# EAGLE board dnc (EAGLE 7.1.0)
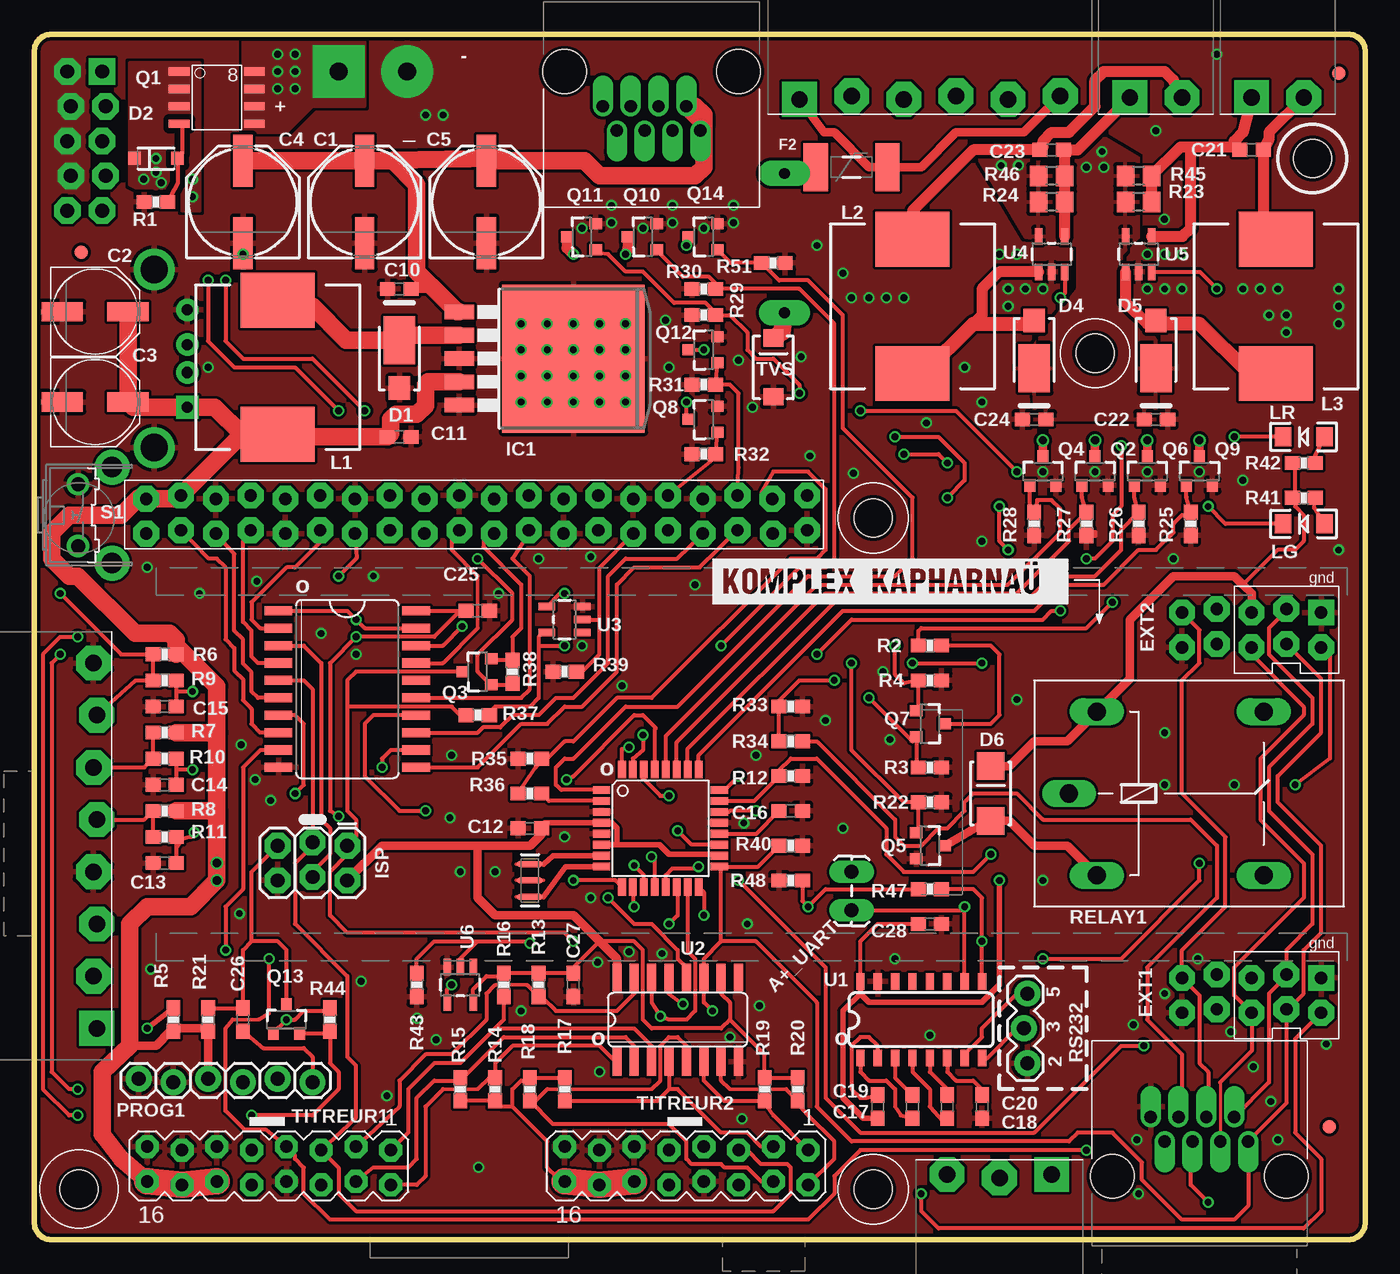
[diagram p1: board, top side]
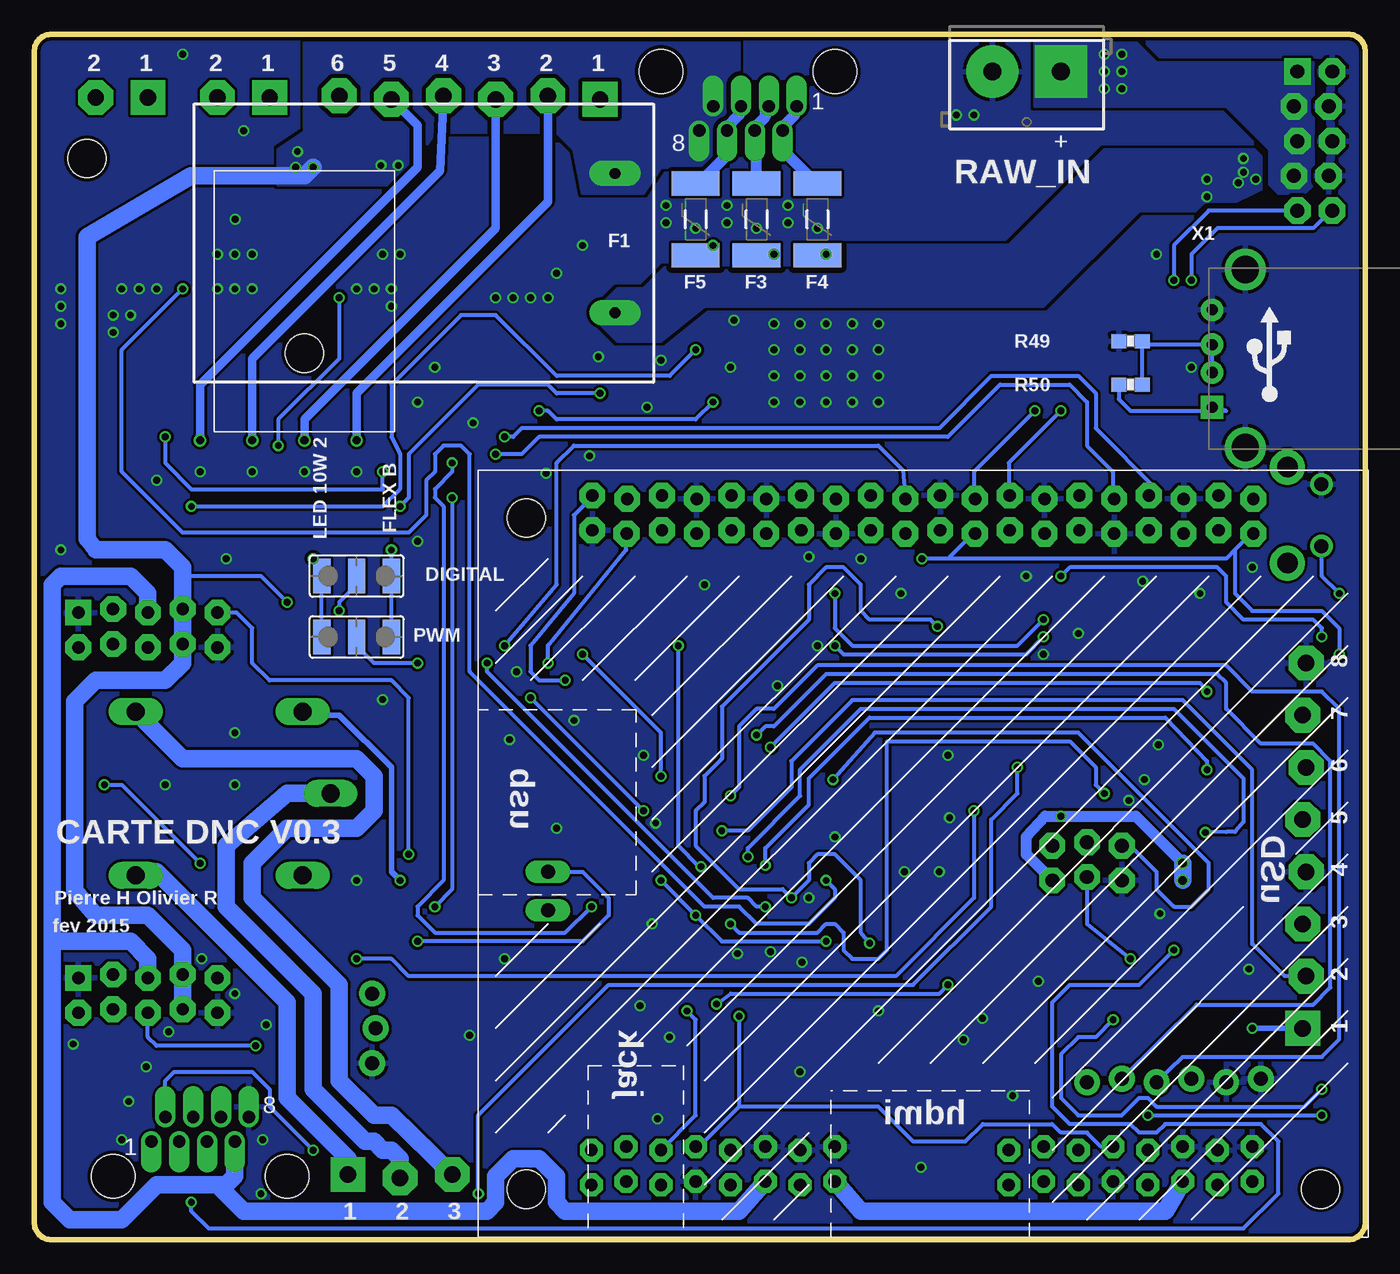
[diagram p2: board, bottom side, seen from below]

Size 97.2 x 88 mm. Coordinates in mm from the lower left corner, seen from the top.
Outline: 0,86.73 0,1.27 arc90 1.27,0 95.93,0 arc90 97.2,1.27 97.2,86.73 arc90 95.93,88 1.27,88 arc90 0,86.73
Copper layers (1*16): Top 0.035mm / dielectric 1.5mm / Bottom 0.035mm
Design rules "SeeedStudio_2layer_DRU_no_angle_20140221 *": minimum track width 6mil, minimum drill 12mil, track to track 6mil, track to pad 6mil, pad to pad 6mil, via to via 6mil, smd to smd 0mil, copper to edge 10mil, drill to drill 10mil, minimum pad ring 12mil, minimum via ring 6mil, stop-mask expansion 2mil, vias tented up to drill 100mil, thermal gap 10mil
Net classes: 0 default: width 0.203 mm; 1 GND: width 0.254 mm; 2 3.3V: width 0.203 mm; 3 5V: width 0.305 mm; 4 230AC: width 0.61 mm, clearance 0.305 mm
Holes 2.8 mm at 93.34,78.93

## Footprints (pad centres in the part's own frame; a part is rotated, then mirrored left to right if it is on the bottom)
RESONATOR-SMD = smd 0.45 x 1.905: 1 -1.2,0; 2 0,0; 3 1.2,0
1X02_LOCK_LONGPADS = drill 1.016 long: 1 -0.127,0; 2 2.667,0
TQFP32-08 = smd 1.27 x 0.559: 1 -4.293,2.8; 2 -4.293,2; 3 -4.293,1.2; 4 -4.293,0.4; 5 -4.293,-0.4; 6 -4.293,-1.2; 7 -4.293,-2; 8 -4.293,-2.8; 17 4.293,-2.8; 18 4.293,-2; 19 4.293,-1.2; 20 4.293,-0.4; 21 4.293,0.4; 22 4.293,1.2; 23 4.293,2; 24 4.293,2.8 | smd 0.559 x 1.27: 9 -2.8,-4.293; 10 -2,-4.293; 11 -1.2,-4.293; 12 -0.4,-4.293; 13 0.4,-4.293; 14 1.2,-4.293; 15 2,-4.293; 16 2.8,-4.293; 25 2.8,4.293; 26 2,4.293; 27 1.2,4.293; 28 0.4,4.293; 29 -0.4,4.293; 30 -1.2,4.293; 31 -2,4.293; 32 -2.8,4.293
PANASONIC_E = smd 3.8 x 1.4: + 3,0; - -3,0
PANASONIC_D = smd 3 x 1.4: + 2.4,0; - -2.4,0
C0603 = smd 1.1 x 1: 1 -0.85,0; 2 0.85,0
DO-221 = smd 1.7 x 1.55: A -2.15,0 | smd 3.5 x 2.3: C 1.35,0
SOD-123 = smd 0.9 x 0.95: A 1.575,0; C -1.575,0
SMA-DIODE_ALT = smd 2 x 2: A -2,0; C 2,0
EXTPINDNC = drill 0.9 pad 1.88 square: 1_GND -1.143,5.08 | drill 0.9 pad 1.88 octagon: 5V -1.143,0; /CS 1.397,5.08; GND2 1.397,-5.08; MISO 1.397,0; MOSI -1.397,2.54; RAW -1.397,-2.54; RAW2 1.143,-2.54; RETOURANALOG -1.143,-5.08; SCK 1.143,2.54
PTC = drill 0.8 pad 1.88 long: P$1MOV -5.08,0; P$2 5.08,0
PTC_1812 = smd 1.78 x 3.5: 1 -2.615,0; 2 2.615,0
PLUG_06 = drill 1.2 pad 2.54 square: 1 -9.525,-0.127 | drill 1.2 pad 2.54 octagon: 2 -5.715,0.127; 3 -1.905,-0.127; 4 1.905,0.127; 5 5.715,-0.127; 6 9.525,0.127
TO263-5 = smd 1.067 x 2.159: 1 -3.404,-5.791; 2 -1.702,-5.791; 3 0,-5.791; 4 1.702,-5.791; 5 3.404,-5.791 | smd 10.8 x 10.41: THERMAL 0,2.54
SO20W = smd 0.66 x 2.032: 1 -5.715,-5.029; 2 -4.445,-5.029; 3 -3.175,-5.029; 4 -1.905,-5.029; 5 -0.635,-5.029; 6 0.635,-5.029; 7 1.905,-5.029; 8 3.175,-5.029; 9 4.445,-5.029; 10 5.715,-5.029; 11 5.715,5.029; 12 4.445,5.029; 13 3.175,5.029; 14 1.905,5.029; 15 0.635,5.029; 16 -0.635,5.029; 17 -1.905,5.029; 18 -3.175,5.029; 19 -4.445,5.029; 20 -5.715,5.029
PLUG_08 = drill 1.2 pad 2.54 square: 1 -13.335,-0.127 | drill 1.2 pad 2.54 octagon: 2 -9.525,0.127; 3 -5.715,-0.127; 4 -1.905,0.127; 5 1.905,-0.127; 6 5.715,0.127; 7 9.525,-0.127; 8 13.335,0.127
2X3_LOCK = drill 1.016 pad 1.88 octagon: 1 0,0; 2 0,2.54; 3 2.54,-0.254; 4 2.54,2.286; 5 5.08,0; 6 5.08,2.54
2X5_LOCK = drill 1.016 pad 1.93 octagon: 1 -5.08,-1.143; 2 -5.08,1.397; 3 -2.54,-1.397; 4 -2.54,1.143; 5 0,-1.143; 6 0,1.397; 7 2.54,-1.397; 8 2.54,1.143; 10 5.08,1.397 | drill 1.016 pad 1.93 square: 9 5.08,-1.143
FIDUCIAL-1X2.5 = smd 1 x 1: 1 0,0
CDRH125 = smd 5.4 x 4: 1 0,4.9; 2 0,-4.9
PLUG_02 = drill 1.2 pad 2.54 square: 1 -1.905,0 | drill 1.2 pad 2.54 octagon: 2 1.905,0
LED-1206 = smd 1.2 x 1.4: A -1.5,0; C 1.5,0
1X06_LOCK = drill 1.016 pad 1.88: 1 0,0; 2 2.54,-0.254; 3 5.08,0; 4 7.62,-0.254; 5 10.16,0; 6 12.7,-0.254
SO-8 = smd 1.524 x 0.61: 1 -2.743,1.905; 2 -2.743,0.635; 3 -2.743,-0.635; 4 -2.743,-1.905; 5 2.743,-1.905; 6 2.743,-0.635; 7 2.743,0.635; 8 2.743,1.905
SOT23-3 = smd 0.8 x 0.9: 1 -0.95,-1; 2 0.95,-1; 3 0,1.1
0603-RES = smd 1.1 x 1: 1 -0.85,0; 2 0.85,0
R0805 = smd 1.3 x 1.5: 1 -0.95,0; 2 0.95,0
DNC_IN2_PWR = drill 1.3 pad 3.81 square: 1 0,0 | drill 1.3 pad 3.81: 2 5,0
PLUG_03 = drill 1.2 pad 2.54 square: 1 -1.905,-0.127 | drill 1.2 pad 2.54 octagon: 2 1.905,0.127; 3 5.715,-0.127
G5LE = drill 1.321 long: 1 -7.493,-5.969; 2 -7.493,5.969; O 4.699,5.969; P -9.525,0; S 4.699,-5.969
RJ45-TRAFO = drill 0.9 offset: 1 -2.54,2.54; 2 -3.556,4.318; 3 -0.508,2.54; 4 -1.524,4.318; 5 1.524,2.54; 6 0.508,4.318; 7 3.556,2.54; 8 2.54,4.318 | hole 3.2: -6.35,0; 6.35,0
1X03_LOCK = drill 1.016 pad 1.88: 1 0,0.127; 2 2.54,-0.127; 3 5.08,0.127
B3F-31XX = drill 1.016: 1 -2.261,-1.245; 2 2.261,-1.245 | drill 1.499 pad 2.54: 3 -3.505,1.245; 4 3.505,1.245
PAD-JUMPER-3-NO_YES_SILK_FULL_BOX_WIDE_SPACING = smd 1.27 x 2.54: 1 -2.54,0; 2 0,0; 3 2.54,0
DNC_TITREUR = drill 0.9 pad 1.676 octagon: 1 -8.89,-1.143; 2 -8.89,1.397; 3 -6.35,-1.397; 4 -6.35,1.143; 5 -3.81,-1.143; 6 -3.81,1.397; 7 -1.27,-1.397; 8 -1.27,1.143; 9 1.27,-1.143; 10 1.27,1.397; 11 3.81,-1.397; 12 3.81,1.143; 13 6.35,-1.143; 14 6.35,1.397; 15 8.89,-1.397; 16 8.89,1.143
SMA-DIODE = smd 1.27 x 1.47: A -2.15,0; C 2.15,0
SO016 = smd 0.6 x 1.2: 1 -4.445,-2.8; 2 -3.175,-2.8; 3 -1.905,-2.8; 4 -0.635,-2.8; 5 0.635,-2.8; 6 1.905,-2.8; 7 3.175,-2.8; 8 4.445,-2.8; 9 4.445,2.8; 10 3.175,2.8; 11 1.905,2.8; 12 0.635,2.8; 13 -0.635,2.8; 14 -1.905,2.8; 15 -3.175,2.8; 16 -4.445,2.8
SO16 = smd 0.66 x 2.032: 1 -4.445,-3.073; 2 -3.175,-3.073; 3 -1.905,-3.073; 4 -0.635,-3.073; 5 0.635,-3.073; 6 1.905,-3.073; 7 3.175,-3.073; 8 4.445,-3.073; 9 4.445,3.073; 10 3.175,3.073; 11 1.905,3.073; 12 0.635,3.073; 13 -0.635,3.073; 14 -1.905,3.073; 15 -3.175,3.073; 16 -4.445,3.073
SOT23-5 = smd 0.55 x 1.2: 1 -0.95,-1.3; 2 0,-1.3; 3 0.95,-1.3; 4 0.95,1.3; 5 -0.95,1.3
RADIATEUR_577102B00000G = hole 2.8: 0,0
RASPIA+ = drill 0.9 pad 1.88 octagon: 1 -51.353,-56.59; 2 -53.893,-56.59; 3 -51.607,-54.05; 4 -54.147,-54.05; 5 -51.353,-51.51; 6 -53.893,-51.51; 7 -51.607,-48.97; 8 -54.147,-48.97; 9 -51.353,-46.43; 10 -53.893,-46.43; 11 -51.607,-43.89; 12 -54.147,-43.89; 13 -51.353,-41.35; 14 -53.893,-41.35; 15 -51.607,-38.81; 16 -54.147,-38.81; 17 -51.353,-36.27; 18 -53.893,-36.27; 19 -51.607,-33.73; 20 -54.147,-33.73; 21 -51.353,-31.19; 22 -53.893,-31.19; 23 -51.607,-28.65; 24 -54.147,-28.65; 25 -51.353,-26.11; 26 -53.893,-26.11; 27 -51.607,-23.57; 28 -54.147,-23.57; 29 -51.353,-21.03; 30 -53.893,-21.03; 31 -51.607,-18.49; 32 -54.147,-18.49; 33 -51.353,-15.95; 34 -53.893,-15.95; 35 -51.607,-13.41; 36 -54.147,-13.41; 37 -51.353,-10.83; 38 -53.893,-10.87; 39 -51.607,-8.33; 40 -54.147,-8.33 | hole 2.8: -52.5,-3.5; -3.5,-3.5; -3.5,-61.5
USB_F_SATISTRONIC = drill 0.813 pad 1.651 square: + -2.921,-3.556 | drill 0.813 pad 1.651: - -2.921,3.556; DM -2.921,-1.016; DP -2.921,1.016 | drill 2 pad 3: S1 -0.508,6.5; S2 -0.508,-6.5

## Placement (x,y rotation side)
16MHZ  16MHZ  [RESONATOR-SMD]  36.2,26.23 270 top
A+_UART  [1X02_LOCK_LONGPADS]  59.69,24.19 90 top
AT328  ATMEGA328  [TQFP32-08]  45.72,30.04 0 top
C1  220uF  [PANASONIC_E]  24.13,75.75 90 top
C2  100u  [PANASONIC_D]  4.45,67.75 0 top
C3  100u  [PANASONIC_D]  4.45,61.15 0 top
C4  220uF  [PANASONIC_E]  15.24,75.75 90 top
C5  220uF  [PANASONIC_E]  33.02,75.75 90 top
C10  0.1uF  [C0603]  26.67,69.41 180 top
C11  0.1uF  [C0603]  26.67,58.61 0 top
C12  0.1uF  [C0603]  36.2,30.04 180 top
C13  1uF  [C0603]  9.53,27.5 180 top
C14  1uF  [C0603]  9.53,33.21 180 top
C15  1uF  [C0603]  9.53,38.92 180 top
C16  0.1uF  [C0603]  55.24,31.3 0 top
C17  0.1uF  [C0603]  64.14,9.71 90 top
C18  0.1uF  [C0603]  66.67,9.71 90 top
C19  0.1uF  [C0603]  61.59,9.71 90 top
C20  0.1uF  [C0603]  69.22,9.71 270 top
C21  1uF  [C0603]  88.9,79.56 0 top
C22  0.1uF  [C0603]  81.92,59.88 0 top
C23  1uF  [C0603]  74.3,79.56 180 top
C24  0.1uF  [C0603]  73.03,59.88 180 top
C25  0.1uF  [C0603]  32.38,45.91 0 top
C26  0.1uF  [C0603]  15.24,16.06 90 top
C27  0.1uF  [C0603]  39.37,18.61 270 top
C28  0.1uF  [C0603]  65.41,23.05 0 top
D1  40v5A  [DO-221]  26.67,64.33 90 top
D2  10V  [SOD-123]  8.89,78.93 0 top
D4  40v5A  [DO-221]  73.03,64.96 270 top
D5  40v5A  [DO-221]  81.92,64.96 270 top
D6  [SMA-DIODE_ALT]  69.85,32.58 90 top
EXT1  EXT  [EXTPINDNC]  88.9,17.97 270 top
EXT2  EXT  [EXTPINDNC]  88.9,44.64 270 top
F1  8A  [PTC]  54.78,72.75 90 bottom
F2  PTC1812  [PTC_1812]  59.69,78.3 0 top
F3  PTC1812  [PTC_1812]  44.45,74.48 90 bottom
F4  PTC1812  [PTC_1812]  40.01,74.48 90 bottom
F5  PTC1812  [PTC_1812]  48.9,74.48 90 bottom
GYRO-LED  PLUG-6  [PLUG_06]  65.41,83.38 0 top
IC1  LM2596S  [TO263-5]  36.83,64.33 270 top
IC2  74ACT244SC  [SO20W]  22.86,40.2 270 top
INPUT  PLUG-8  [PLUG_08]  4.45,28.77 90 top
ISP  AVR_SPI_PRG_62X3_LOCK  [2X3_LOCK]  22.86,28.77 180 top
JP1  CHARGEUR  [2X5_LOCK]  3.81,80.2 90 top
JP13  FIDUCIAL1X2.5  [FIDUCIAL-1X2.5]  3.43,72.07 0 top
JP14  FIDUCIAL1X2.5  [FIDUCIAL-1X2.5]  95.25,85.15 180 top
JP19  FIDUCIAL1X2.5  [FIDUCIAL-1X2.5]  94.56,8.23 0 top
L1  68nH3A  [CDRH125]  17.78,63.69 0 top
L2  100nH2.4A  [CDRH125]  64.14,68.14 180 top
L3  100nH2.4A  [CDRH125]  90.68,68.14 180 top
LED10W1  PLUG-2  [PLUG_02]  90.81,83.38 0 top
LED10W2  PLUG-2  [PLUG_02]  81.92,83.38 0 top
LG  [LED-1206]  92.71,52.26 180 top
LR  [LED-1206]  92.71,58.61 180 top
PROG1  [1X06_LOCK]  20.32,11.49 180 top
Q1  IRF9321PBF  [SO-8]  13.34,83.38 0 top
Q2  BSS670  [SOT23-3]  77.47,56.07 0 top
Q3  BSS138  [SOT23-3]  32.38,41.47 90 top
Q4  BSS670  [SOT23-3]  73.66,56.07 0 top
Q5  BSS138  [SOT23-3]  65.41,28.77 270 top
Q6  BSS316  [SOT23-3]  81.28,56.07 0 top
Q7  BSS138  [SOT23-3]  65.41,37.66 270 top
Q8  BSS138  [SOT23-3]  48.9,59.88 90 top
Q9  BSS670  [SOT23-3]  85.09,56.07 0 top
Q10  FDN337N  [SOT23-3]  44.45,73.22 90 top
Q11  FDN337N  [SOT23-3]  40.01,73.22 90 top
Q12  BSS138  [SOT23-3]  48.9,64.96 90 top
Q13  BSS138  [SOT23-3]  18.41,16.06 0 top
Q14  FDN337N  [SOT23-3]  48.9,73.22 90 top
R1  100K  [0603-RES]  8.89,75.75 180 top
R2  100k1%  [0603-RES]  65.41,43.37 180 top
R3  10k1%  [0603-RES]  65.41,34.48 180 top
R4  100K  [0603-RES]  65.41,40.83 180 top
R5  1K  [0603-RES]  10.16,16.06 270 top
R6  56K  [0603-RES]  9.53,42.73 0 top
R7  56K  [0603-RES]  9.53,37.02 0 top
R8  56K  [0603-RES]  9.53,31.3 0 top
R9  33K  [0603-RES]  9.53,40.83 0 top
R10  33K  [0603-RES]  9.53,35.11 0 top
R11  33K  [0603-RES]  9.53,29.4 0 top
R12  5.1K  [0603-RES]  55.24,33.84 0 top
R13  100K  [0603-RES]  36.83,18.61 90 top
R14  100K  [0603-RES]  33.66,10.98 270 top
R15  100K  [0603-RES]  31.11,10.98 270 top
R16  100K  [0603-RES]  34.29,18.61 90 top
R17  100K  [0603-RES]  38.73,10.98 90 top
R18  100K  [0603-RES]  36.2,10.98 90 top
R19  100K  [0603-RES]  53.34,10.98 90 top
R20  100K  [0603-RES]  55.75,10.98 90 top
R21  10K  [0603-RES]  12.7,16.06 270 top
R22  100K  [0603-RES]  65.41,31.94 180 top
R23  0.110  [R0805]  80.64,75.75 180 top
R24  0.110  [R0805]  74.3,75.75 180 top
R25  100K  [0603-RES]  84.45,52.26 90 top
R26  100K  [0603-RES]  80.64,52.26 90 top
R27  100K  [0603-RES]  76.83,52.26 90 top
R28  100K  [0603-RES]  73.03,52.26 90 top
R29  100K  [0603-RES]  48.9,67.5 0 top
R30  100K  [0603-RES]  48.9,69.41 0 top
R31  100K  [0603-RES]  48.9,62.42 0 top
R32  100K  [0603-RES]  48.9,57.34 0 top
R33  20K  [0603-RES]  55.24,38.92 180 top
R34  10K  [0603-RES]  55.24,36.38 0 top
R35  20K  [0603-RES]  36.2,35.11 0 top
R36  10K  [0603-RES]  36.2,32.58 0 top
R37  10K  [0603-RES]  32.38,38.29 0 top
R38  10K  [0603-RES]  34.92,41.47 270 top
R39  10K  [0603-RES]  38.73,41.47 0 top
R40  10K  [0603-RES]  55.24,28.77 180 top
R41  1K  [0603-RES]  92.71,54.16 180 top
R42  1K  [0603-RES]  92.71,56.7 180 top
R43  10K  [0603-RES]  27.94,18.61 90 top
R44  10K  [0603-RES]  21.59,16.06 90 top
R45  OPT  [R0805]  80.64,77.66 180 top
R46  OPT  [R0805]  74.3,77.66 180 top
R47  10K  [0603-RES]  65.41,25.59 0 top
R48  20K  [0603-RES]  55.24,26.23 0 top
R49  22K  [0603-RES]  17.14,65.59 0 bottom
R50  33K  [0603-RES]  17.14,62.42 0 bottom
R51  100K  [0603-RES]  53.98,71.31 180 top
RAW_IN  DNC_IN2PWR  [DNC_IN2_PWR]  22.23,85.28 180 bottom
RELAY  PLUG-3  [PLUG_03]  72.39,4.63 180 top
RELAY1  G5L  [G5LE]  85.09,32.58 0 top
RGB-LED  RJ45-RGBLED  [RJ45-TRAFO]  45.09,85.28 180 top
RS232  [1X03_LOCK]  72.39,17.97 270 top
S1  [B3F-31XX]  4.45,52.9 270 top
SJ1  JUMPER-PAD-3-NO  [PAD-JUMPER-3-NO_YES_SILK_FULL_BOX_WIDE_SPACING]  73.66,48.45 0 bottom
SJ2  JUMPER-PAD-3-NO  [PAD-JUMPER-3-NO_YES_SILK_FULL_BOX_WIDE_SPACING]  73.66,44.01 0 bottom
TITREUR1  DNC_TITREUR  [DNC_TITREUR]  17.14,5.4 180 top
TITREUR2  DNC_TITREUR  [DNC_TITREUR]  47.62,5.4 180 top
TVS  TVS-30V  [SMA-DIODE]  53.98,63.69 90 top
U1  MAX202CDWR  [SO016]  64.77,16.06 0 top
U2  74HCT595D  [SO16]  46.99,16.06 0 top
U3  TC7SU04F  [SOT23-5]  38.73,45.27 90 top
U4  AL8805WS  [SOT23-5]  74.3,71.94 0 top
U5  AL8805WS  [SOT23-5]  80.64,71.94 0 top
U6  TC7SU04F  [SOT23-5]  31.11,18.61 180 top
U$1  RADIATEUR  [RADIATEUR_577102B00000G]  77.47,64.71 270 bottom
U$2  LOGOSIZE2  [KXKMLOGO2]  49.53,42.73 0 top
U$4  RASPIA+  [RASPIA+]  64.77,0.19 270 top
U$8  RJ45-EXTDNC  [RJ45-TRAFO]  85.09,4.63 0 top
X1  USB  [USB_F_SATISTRONIC]  8.26,64.33 0 bottom

## Tracks (layer width: path | path; a pad name or v marks a point on that pad's centre or on a via)
+3V3  (via drill 0.5)
  Top 0.305: R38.2 34.83,40.52 Q3.1 33.34,40.52 32.38,41.47 32.38,42.73 34.92,45.27 34.92,47.18 v32.38,49.72 | Q13.1 17.46,15.12 v18.41,16.06 19.05,16.06 19.68,16.7 21.38,16.7 R44.2 | v3.17,10.98 2.54,10.98 1.27,12.26 1.27,42.1 v1.91,42.73
  Bottom 0.305: U$4.17 28.02,52.18 30.48,49.72 | 30.48,49.72 v32.38,49.72 | U$4.1 8.34,51.54 9.53,50.35 | 9.53,50.35 10.16,49.72 30.48,49.72 | v3.17,10.98 4.45,9.71 15.24,9.71 15.88,10.35 16.51,10.35 17.78,9.08 20.95,9.08 22.23,10.35 22.23,13.53 20.95,14.79 19.68,14.79 v18.41,16.06 | v1.91,42.73 1.91,44.64 3.17,45.91 8.26,45.91 9.53,47.18 9.53,50.35
+5V  (via drill 0.5, 0.6)
  Top 0.305: IC2.20 31.11,45.91 | C25.1 31.11,45.91 | 31.11,45.91 29.21,44.01 v23.5,44.01 21.59,42.1 21.59,31.3 v22.23,30.92 | U2.10 50.16,17.97 50.8,17.34 50.8,16.06 | 50.8,16.06 50.16,15.43 45.09,15.43 44.45,16.06 44.45,21.14 43.81,21.78 41.27,21.78 39.37,19.88 C27.1 R13.2 R16.2 34.08,19.24 33.02,19.24 32.06,18.29 U6.5 | U3.5 37.15,44.33 36.83,44.01 36.83,43.37 | 36.83,43.37 36.83,39.56 36.2,38.92 33.66,38.92 33.23,38.51 R37.2 | 36.83,43.37 v38.73,43.37 | 50.8,16.06 53.34,13.53 R19.2 R20.2 | U1.16 60.33,21.78 61.59,23.05 C28.1 | 34.92,9.71 37.47,7.17 37.47,5.27 38.1,4.63 38.35,4.63 TITREUR2.16 | 34.92,9.71 34.08,9.71 R14.2 R15.2 | 34.92,9.71 34.92,10.98 35.56,11.62 35.98,11.62 R18.2 R17.2 | 92.08,54.16 R41.2 91.86,53.95 92.08,54.16 | 92.08,54.16 92.08,56.49 R42.2 | 92.08,54.16 92.08,53.53 92.71,52.9 92.71,50.99 92.08,50.35 90.81,50.35 88.27,47.81 | 12.7,15.43 R21.2
  Top 0.406: C12.1 37.28,30.43 AT328.4 42.15,30.43 42.55,30.04 42.55,28.84 | AT328.6 42.55,28.84 | 42.55,28.84 45.65,28.84 46.35,28.13 49.92,28.13 AT328.18 | U1.16 60.33,17.97 | 60.33,17.97 60.96,17.34 69.22,17.34 70.48,18.61 v70.48,26.23 | C19.1 60.54,8.87 59.05,10.35 59.05,16.7 60.33,17.97
  Top 0.61: C12.1 37.05,29.61 36.2,28.77 32.38,28.77 | 32.38,28.77 25.4,28.77 ISP.2 | 32.38,28.77 32.38,24.95 33.66,23.68 39.37,23.68 41.27,21.78 42.55,20.51 U2.16 | D6.C 71.22,34.58 73.03,36.38 75.44,36.38 RELAY1.2 80.01,40.96 80.01,45.27 83.19,48.45 87.63,48.45 88.27,47.81 88.9,47.18 EXT2.5V | PROG1.4 R21.2 | 12.7,15.43 10.38,15.43 R5.2 9.95,15.21 8.89,14.16 6.99,14.16
  Top 1.27: R6.2 10.38,43.37 | 10.38,43.37 10.38,43.79 9.91,44.26 7.37,44.26 3.17,48.45 2.54,48.45 1.27,49.72 1.27,51.62 2.54,52.9 6.35,52.9 7.62,54.16 8.1,54.16 U$4.2 10.47,54.08 U$4.4 15.17,58.79 | R7.2 13.34,37.02 | 13.34,37.02 13.34,40.41 10.38,43.37 | R8.2 13.34,31.3 | 13.34,31.3 13.34,37.02 | 13.34,31.3 v13.34,27.5 v13.34,26.23 11.43,24.32 8.26,24.32 6.99,23.05 6.99,14.16 4.95,12.26 4.95,7.68 6.35,5.91 TITREUR1.16 | IC1.4 28.78,62.62 28.57,62.42 28.57,60.9 27.94,60.26 26.42,60.26 26.04,59.88 26.04,58.83 C11.1 17.96,58.61 L1.2 15.17,58.79 | 15.17,58.79 13.19,60.77 X1.+ 7.23,60.77 C3.+ C2.+
  Top 1.93: TITREUR1.16 TITREUR1.14 TITREUR1.12 | TITREUR2.16 TITREUR2.14 TITREUR2.12
  Bottom 0.305: v38.73,43.37 38.1,42.73 24.77,42.73 v23.5,44.01 | R50.1 18,61.37 17.14,60.52 10.16,60.52 X1.+
  Bottom 0.406: v70.48,26.23 71.12,26.86 71.12,34.48 74.93,38.29 77.34,38.29 RELAY1.2
  Bottom 0.813: ISP.2 24.77,28.13 24.77,29.4 23.37,30.92 v22.23,30.92 16.76,30.92 v13.34,27.5
  Bottom 1.27: TITREUR1.12 14.61,2.09 36.83,2.09 TITREUR2.16 | v13.34,27.5 v13.34,26.23 | TITREUR2.12 45.72,2.09 58.42,2.09 59.05,2.73 59.05,4.63 60.33,5.91 62.23,5.91 63.5,4.63 63.5,2.73 64.14,2.09 81.92,2.09 83.5,3.68 83.19,4 | 95.89,21.78 95.89,47.81 95.25,48.45 90.17,48.45 88.9,47.18 EXT2.5V | EXT1.5V 88.9,20.51 90.17,21.78 95.89,21.78 | U$8.1 82.55,4.63 83.19,4 | 83.19,4 88.27,4 90.81,1.46 94.61,1.46 95.89,2.73 95.89,21.78
/REG_RCK_5V=ACTIVE_CS  (via drill 0.5)
  Top 0.254: U6.4 30.16,17.02
  Top 0.305: U2.13 46.35,17.97 v47.37,17.21 | U6.4 30.16,18.29 v30.48,18.61
  Bottom 0.305: v47.37,17.21 46.35,17.97 31.11,17.97 v30.48,18.61
ALL_CS_ENABLE_ACTIVE_LOW_5V  (via drill 0.5)
  Top 0.305: IC2.1 22.86,45.91 v23.5,45.27 24.13,44.64 IC2.19 | U3.4 38.39,47.18 v38.73,47.18
  Bottom 0.305: v38.73,47.18 38.73,44.64 37.47,43.37 25.4,43.37 v23.5,45.27
ANALOG_RAW  (via drill 0.5)
  Top 0.254: 64.41,34.63 R3.2
  Top 0.305: 64.41,34.63 Q7.2 64.14,36.38 v60.96,39.56 | v52.7,31.3 50.8,31.3 50.73,31.23 AT328.22
  Bottom 0.305: v60.96,39.56 v52.7,31.3
AREF
  Top 0.305: AT328.20 52.73,29.64 C16.1
ATMEGA_CS
  Top 0.305: U$4.33 46.95,49.72 43.18,49.72 41.91,48.45 41.91,42.1 39.37,39.56 38.1,39.56 36.83,38.29 34.92,38.29 34.04,37.4 32.77,37.4 32.38,37.02 IC2.13
ATMEGA_CS_5V  (via drill 0.5)
  Top 0.305: AT328.14 46.99,25.67 46.99,23.68 v46.35,23.05 | IC2.7 19.05,38.29 19.68,37.66 19.68,33.21 v19.05,32.58
  Bottom 0.305: v46.35,23.05 45.72,22.41 40.01,22.41 39.37,23.05 38.73,23.05 38.1,22.41 38.1,21.14 37.47,20.51 35.56,20.51 34.92,21.14 34.92,36.38 21.59,36.38 19.68,34.48 19.68,33.21 v19.05,32.58
BB
  Bottom 0.813: F4.2 40.08,77.1 42.55,79.56 RGB-LED.8 42.55,81.22 41.66,82.11 41.66,82.61 RGB-LED.7
CHARGING  (via drill 0.5)
  Top 0.305: v12.7,70.04 12.7,65.59 14.61,63.69 19.05,63.69 v22.23,60.52
  Bottom 0.305: JP1.2 2.54,75.12 3.81,73.85 10.79,73.85 12.7,71.94 v12.7,70.04 | v22.23,60.52 26.04,56.7 26.04,54.41 U$4.16
CODE  (via drill 0.5)
  Top 0.254: 54.3,33.94 R12.1
  Top 0.305: EXT2.RETOURANALOG 85.09,44.51 85.09,42.1 83.82,40.83 83.82,32.58 87,29.4 87,24.32 83.82,21.14 EXT1.RETOURANALOG 85.09,17.84 85.09,12.89 85.72,12.26 85.72,9.08 U$8.6 | v69.85,28.13 68.58,26.86 63.5,26.86 62.23,28.13 62.23,30.04 57.15,35.11 55.24,35.11 54.4,34.27 R12.1 52.59,32.03 AT328.23
  Bottom 0.305: v69.85,28.13 69.85,39.56 71.12,40.83 80.01,40.83 81.28,42.1 81.28,44.64 82.42,45.78 EXT2.RETOURANALOG
CS_TRIGGER_ACTIVE_HIGH
  Top 0.254: U3.2 40.64,45.27 | R39.2 40.01,41.47
  Top 0.305: 40.64,45.27 41.27,45.27 | 41.27,45.27 41.27,49.05 U$4.29 | 40.01,41.47 41.27,42.73 41.27,45.27
DIGITAL_LED2_OR_FLEX3  (via drill 0.5)
  Top 0.305: 51.37,33.77 v51.44,33.84 50.42,32.84 AT328.24 | v57.15,42.73 59.69,45.27 73.66,45.27 74.3,45.91 v74.93,45.91
  Bottom 0.305: v51.44,33.84 51.44,37.02 v57.15,42.73 | SJ1.2 73.66,47.81 74.93,46.55 v74.93,45.91
DTR
  Top 0.305: C26.1 16.73,13.98 19.68,13.98 20.32,13.35 PROG1.1
EXT1_CS
  Top 0.305: IC2.8 16.51,37.02 15.88,37.66 15.88,38.75 15.24,39.38 15.24,40.91 14.61,41.54 14.61,43.2 13.97,43.83 13.97,49.09 13.34,49.72 12.75,49.72 U$4.3
EXT1_CS_5V  (via drill 0.5)
  Top 0.305: EXT1./CS 92.08,14.67 92.08,7.81 93.98,5.91 93.98,2.09 92.71,0.83 66.04,0.83 64.77,2.09 v64.77,3.37 | IC2.12 26.04,35.75 25.4,35.11 v25.4,34.48
  Bottom 0.305: v64.77,3.37 64.77,9.08 55.24,18.61 33.02,18.61 27.3,24.32 27.3,30.67 25.4,32.58 v25.4,34.48
EXT2_CS
  Top 0.305: IC2.6 16.34,39.56 15.88,40.02 15.88,41.42 15.24,42.05 15.24,43.83 14.61,44.47 14.61,50.07 U$4.5
EXT2_CS_5V  (via drill 0.5)
  Top 0.305: IC2.14 24.77,38.29 24.13,37.66 24.13,33.84 26.67,31.3 v28.57,31.3 | v73.66,20.51 79.38,20.51 85.09,26.23 v85.09,27.5 | EXT2./CS 94.61,42.61 94.61,35.11 v92.08,33.21
  Bottom 0.305: v28.57,31.3 28.57,24.95 34.29,19.24 69.85,19.24 71.12,20.51 v73.66,20.51 | v85.09,27.5 90.81,33.21 v92.08,33.21
EXT3_CS
  Top 0.305: IC2.4 16.34,42.1 15.88,42.56 15.88,44.47 15.24,45.1 15.24,50.96 U$4.7
FLOAT1  (via drill 0.5)
  Top 0.305: AT328.19 48.02,28.84 v46.99,29.86
  Bottom 0.305: INPUT.2 5.89,19.24 8.26,21.61 8.26,34.3 13.34,39.38 37.47,39.38 41.91,34.94 41.91,33.03 45.09,29.86 v46.99,29.86
GG
  Bottom 0.813: F3.2 44.45,80.83 RGB-LED.6 44.58,81.22 43.81,81.98 43.81,82.49 RGB-LED.5
GND  (via drill 0.5)
  Top 0.406: R27.1 77.47,51.41 77.47,51.62
  other vias: 12.06,47.18 24.77,48.45 27.96,16.16 31.11,26.86 8.49,19.76 15.11,36.13 52.07,23.05 87.63,33.21 59.69,68.77 63.5,68.77 71.12,69.41 73.66,69.41 72.39,69.41 62.23,68.77 71.12,68.14 82.55,69.41 88.27,69.41 95.25,69.41 90.81,69.41 91.44,67.5 91.44,66.23 95.25,66.87 71.75,71.94 89.53,69.41 90.17,67.5 83.82,69.41 95.25,68.14 81.28,71.94 81.28,69.41 70.48,71.94 85.09,56.07 81.28,56.07 77.47,56.07 81.92,80.96 46.1,67.12 59.05,70.55 51.05,75.5 57.15,72.58 82.55,33.21 82.55,37.02 73.66,26.23 90.81,7.3 90.3,10.1 80.26,15.68 84.96,20.51 82.55,17.97 8.26,49.09 52.45,60.77 65.41,14.92 71.75,39.43 59.05,30.04 52.7,35.37 62.48,36.51 16.13,33.59 50.8,14.79 35.56,16.7 43.43,21.02 87.38,15.18 62.87,20.51 33.91,47.18 40.01,43.37 42.93,40.45 36.83,49.72 67.94,63.69 86.36,86.55 56.64,57.21 60.96,68.77 32.45,5.3 25.75,10.51 29.36,14.61 33.66,26.86 41.27,12.26 16.26,48.07 73.66,56.07 82.53,74.5 94.36,14.29 80.52,7.3 40.64,24.95 23.5,42.73 35.56,61.15 43.18,61.15 37.47,61.15 39.37,61.15 41.27,61.15 35.56,66.87 37.47,66.87 39.37,66.87 41.27,66.87 43.18,66.87 43.18,64.96 41.27,64.96 39.37,64.96 37.47,64.96 35.56,64.96 35.56,63.05 37.47,63.05 39.37,63.05 41.27,63.05 43.18,63.05 83.82,71.94 82.55,71.94 17.27,32.07 15.24,71.94 23.86,18.87 30.35,30.8 45.85,20.89 41.15,20.26 52.96,17.08 57.78,37.91 14.99,23.81 20.95,44.26 30.48,35.37 51.44,64.2 46.35,63.69 56.01,64.45 40.64,49.85 38.73,29.4 69.22,50.99 48.26,47.81 59.82,55.94 12.7,63.69 28.57,82.11 29.84,82.11 51.82,30.42 61.98,41.47 51.69,8.83 80.64,3.37 89.03,12.64 46.61,75.5 42.16,75.5 40.01,73.85 44.45,73.85 48.9,73.85 42.16,74.23 46.61,74.23 51.05,74.23 65.15,59.63 69.22,61.15 83.19,49.72 88.27,55.44 95.25,50.35
  pour Bottom (isolate 0.203, rank 4): -2.54,90.36 99.69,90.36 99.69,-2.99 -2.54,-2.99
  pour Top (isolate 0.203, rank 4): -3.81,91.63 101.6,91.63 101.6,-4.26 -3.81,-4.26
  pour Top (isolate 0.305, rank 4, no thermals): 24.77,87.82 30.48,87.82 30.48,82.11 24.77,82.11
  pour Top (isolate 0.254, no thermals): -0.64,89.09 3.81,89.09 3.81,73.85 -0.64,73.85
GYRO_1
  Top 0.305: Q4.1 72.71,52.94 R28.2 73.24,53.99 74.3,53.99 74.93,53.35 74.93,51.62 71.12,47.81 57.15,47.81 46.12,36.78 AT328.28
GYRO_2
  Top 0.305: Q2.1 76.52,54.2 R27.2 75.56,51.84 75.56,50.99 71.75,47.18 57.78,47.18 46.92,36.31 AT328.27
GYRO_3
  Top 0.305: Q6.1 80.33,54.2 R26.2 79.38,51.84 79.38,50.35 77.47,48.45 74.3,48.45 72.39,46.55 58.42,46.55 47.72,35.84 AT328.26
GYRO_4
  Top 0.305: Q9.1 84.14,54.2 R25.2 84.24,52.9 83.82,52.9 83.19,52.26 83.19,51.62 81.92,50.35 80.64,50.35 78.11,47.81 74.93,47.81 73.03,45.91 59.05,45.91 48.52,35.38 AT328.25
INT_ATMEGA
  Top 0.305: R36.1 R35.2 37.47,35.11 | U$4.38 53.13,54.59 53.98,56.07 56.52,56.07 57.78,54.8 57.78,50.35 57.15,49.72 55.24,49.72 45.09,39.56 42.55,39.56 39.37,36.38 38.73,36.38 37.47,35.11 | 37.47,35.11 36.62,34.48
INT_ATMEGA_5V
  Top 0.305: AT328.2 37.59,32.03 R36.2
INT_TELECO  (via drill 0.5)
  Top 0.305: R34.1 R33.2 54.4,39.34 55.88,40.83 v58.42,40.83
  Bottom 0.305: U$4.40 56.34,54.34 57.78,52.9 57.78,47.18 60.96,43.37 60.96,41.47 60.33,40.83 v58.42,40.83
INT_TELECO_5V
  Top 0.305: R34.2 57.15,36.38 62.87,30.67 62.87,29.4 63.5,28.77 64.77,28.77 66.04,30.04 66.67,30.04 67.94,31.3 67.94,31.94 68.58,32.58 71.75,32.58 73.66,30.67 84.45,30.67 86.36,28.77 86.36,24.95 81.28,19.88 81.28,16.06 83.82,13.53 83.82,9.21 U$8.4
LED+1
  Top 0.813: U4.4 R24.1 R46.1 75.25,79.47 C23.1 76.2,79.56 LED10W2.1
LED+2
  Top 0.813: LED10W1.1 88.27,80.83 87.63,80.2 87.63,79.77 | 87.63,79.77 C21.1 | 87.63,79.77 84.45,79.77 | 84.45,79.77 83.7,79.77 R45.1 R23.1 | U5.4 83.85,73.25 84.45,73.85 84.45,79.77
LED-1
  Top 0.813: LED10W2.2 83.19,84.64 82.55,85.28 78.11,85.28 77.47,84.64 77.47,82.74 75.56,80.83 74.3,80.83 73.66,80.2 73.66,79.78 C23.2 68.58,79.56 64.14,75.12 L2.2 64.59,73.03
LED-2
  Top 0.813: LED10W1.2 90.17,80.83 90.17,80.33 C21.2 89.75,73.96 L3.2
LED_G
  Top 0.305: U$4.36 51.44,56.37 51.44,61.78 50.8,62.42 R31.2 49.9,63.84 Q12.1
LED_R
  Top 0.305: U$4.32 49.74,57.14 R32.2 49.9,58.76 Q8.1
LEDR  (via drill 0.5)
  Top 0.305: LR.C v87.63,58.61 | Q8.3 47.62,59.88 v47.62,61.15 | v60.33,60.52 67.31,60.52 v71.75,56.07
  Bottom 0.305: v87.63,58.61 87.63,56.7 85.72,54.8 71.75,54.8 v71.75,56.07 | v47.62,61.15 48.9,59.88 59.05,59.88 59.69,60.52 v60.33,60.52
LG  (via drill 0.5)
  Top 0.305: LG.C 87,52.26 v85.72,53.53 | Q12.3 v48.9,64.96
  Bottom 0.305: v85.72,53.53 71.75,53.53 70.48,54.8 70.48,57.34 71.12,58.61 71.12,62.42 66.04,67.5 63.5,67.5 59.05,63.05 50.8,63.05 v48.9,64.96
MISO
  Top 0.254: 32.8,51.87 U$4.21
  Top 0.305: 32.8,51.87 32.8,50.57 35.56,47.81 35.56,44.64 34.92,44.01 R38.1 33.48,42.31 Q3.2
MISO_5V  (via drill 0.5)
  Top 0.203: 86.61,11.49 U$8.5
  Top 0.305: Q3.3 23.5,41.47 22.86,40.83 22.86,38.92 | R37.1 31.11,38.29 30.48,38.92 22.86,38.92 | 22.86,38.92 22.86,31.3 23.5,30.67 23.5,29.4 ISP.1 22.86,28.13 21.59,26.86 21.59,23.68 22.86,22.41 38.73,22.41 v39.37,21.78 | EXT2.MISO 88.9,42.73 92.71,38.92 92.71,38.29 89.53,35.11 89.53,30.67 92.71,27.5 92.71,24.95 87.63,19.88 87.63,17.84 EXT1.MISO 88.9,13.78 86.61,11.49 | AT328.16 48.9,25.37 v48.9,23.68 | v51.44,26.23 57.78,19.88 57.78,10.35 60.33,7.81 73.03,7.81 79.38,14.16 v81.03,14.16
  Bottom 0.305: v39.37,21.78 46.99,21.78 v48.9,23.68 v51.44,26.23 | v81.03,14.16 88.27,14.16 88.9,14.79 EXT1.MISO
MOSI
  Top 0.254: 30.48,51.36 U$4.19 | 32.38,48.45 32.38,44.64
  Top 0.305: IC2.17 29.84,42.1 32.38,44.64 | 30.48,51.36 30.48,50.35 32.38,48.45
MOSI_5V  (via drill 0.5)
  Top 0.254: 14.48,16.06 16.38,16.06
  Top 0.305: IC2.3 19.68,43.37 20.95,42.1 20.95,30.67 21.59,30.04 21.59,28.13 20.32,26.86 ISP.4 | v17.14,20.51 17.14,16.52 16.38,16.06 | EXT2.MOSI 91.44,45.91 90.17,44.64 90.17,42.73 93.34,39.56 93.34,37.66 90.17,34.48 90.17,31.3 93.34,28.13 93.34,23.05 91.44,21.14 EXT1.MOSI 91.44,19.24 90.17,17.97 90.17,11.49 U$8.8 | U2.14 45.09,17.34 v45.72,16.32 46.35,16.06 47.62,16.06 48.26,16.7 48.26,20.51 47.72,21.05 AT328.15 | 14.48,16.06 13.97,15.43 13.97,9.41 15.37,8.02 16.94,8.02 TITREUR1.7 19.05,6.16 19.05,5.91 19.68,5.27 19.68,3.37 21.59,1.46 56.52,1.46 58.42,3.37 58.42,4.63 60.33,6.54 v76.83,6.54
  Bottom 0.254: ISP.4 20.32,25.59
  Bottom 0.305: 20.32,25.59 20.32,23.05 v17.14,20.51 | v45.72,16.32 45.72,9.71 | U$8.8 87.63,11.62 87,12.26 81.28,12.26 80.01,10.98 80.01,9.71 v76.83,6.54 | 45.72,9.71 48.26,7.17 48.51,7.17 TITREUR2.7 | TITREUR1.7 19.3,6.79 20.32,7.81 22.23,7.81 22.86,8.45 27.94,8.45 29.21,7.17 33.02,7.17 35.56,9.71 45.72,9.71
N$1
  Top 1.27: IC1.2 27.02,66.03 D1.C 22.78,65.67 20.32,68.14 18.23,68.14 L1.1
N$3
  Top 0.305: Q7.3 69.85,37.66 70.48,38.29 70.48,42.73 69.85,43.37 R2.1
N$5
  Top 0.61: GYRO-LED.1 57.66,80.83 58.42,80.83 60.96,78.3 F2.2 64.77,78.3 67.31,80.83 72.26,80.83 GYRO-LED.6
N$6
  Top 0.813: U4.1 70.45,70.64 69.22,69.41 69.22,67.5 68.58,66.87
  Top 1.016: L2.1 64.95,63.23 68.58,66.87 72.78,66.87 D4.A
N$7
  Top 0.813: U5.1 79.69,68.45 81.28,66.87 81.67,66.87 D5.A
  Top 1.016: L3.1 88.72,63.23 85.09,66.87 82.16,66.87 D5.A
N$8
  Bottom 1.27: RELAY1.P 78.74,32.58 83.19,28.77 83.19,24.32 76.83,17.97 76.83,10.98 73.03,7.17 72.39,7.17 71.75,6.54 71.12,6.54 70.48,5.91 RELAY.2
N$10  (via drill 0.6)
  Top 0.61: Q4.3 v73.66,58.36
  Bottom 0.61: GYRO-LED.2 59.69,75.75 73.66,61.78 v73.66,58.36
N$11  (via drill 0.6)
  Top 0.61: Q2.3 v77.47,58.36
  Bottom 0.61: GYRO-LED.3 63.5,73.85 77.47,59.88 v77.47,58.36
N$12  (via drill 0.6)
  Top 0.61: Q6.3 v81.28,58.36
  Bottom 0.61: GYRO-LED.4 67.58,78.03 81.28,64.33 v81.28,58.36
N$13  (via drill 0.6)
  Top 0.61: Q9.3 v85.09,58.36
  Bottom 0.61: v85.09,58.36 85.09,62.42 69.22,78.3 69.22,81.34 GYRO-LED.5
N$16
  Top 0.61: RELAY1.1 75.44,28.77 73.03,28.77 71.22,30.57 D6.A 69.75,30.67 Q5.3
N$17  (via drill 0.5)
  Top 0.813: Q11.3 38.91,72.41 v39.37,71.94
  Bottom 0.813: F4.1 39.45,71.87 v39.37,71.94
N$18
  Top 0.305: LG.A 93.46,53.43 R41.1
N$19  (via drill 0.5)
  Top 0.813: Q10.3 43.35,72.41 v43.18,71.94
  Bottom 0.813: F3.1 43.89,71.87 v43.18,71.94
N$21
  Top 0.305: R42.1 93.56,57.24 LR.A
N$24
  Top 0.305: U1.2 61.59,14.16 60.96,14.79 60.33,14.79 59.69,14.16 59.69,10.98 60.33,10.35 60.74,10.35 C19.2
N$25  (via drill 0.5)
  Top 0.406: v8.26,15.43 R5.1
  Bottom 0.406: INPUT.1 v8.26,15.43
N$26
  Bottom 0.305: X1.DM X1.DP 16.04,65.34 R49.2 R50.2
N$27
  cutout Top: 34.92,28.13 37.47,28.13 37.47,26.86 34.92,26.86
N$28
  cutout Top: 34.92,25.59 37.47,25.59 37.47,24.32 34.92,24.32
N$30  (via drill 0.5)
  Top 0.813: Q14.3 47.8,73.05 v47.62,72.58
  Bottom 0.813: F5.1 48.34,71.87 v47.62,72.58
N$35
  Top 0.305: U1.6 66.67,12.26 67.31,11.62 68.58,11.62 69.22,10.98 C20.1
N$43
  Top 0.406: AT328.7 37.87,28.04 37.21,27.43
N$44
  Top 0.406: AT328.8 38.79,27.23 37.21,25.02
N$50
  Top 0.305: U1.5 65.41,12.26 66.67,10.98 C18.2
N$51
  Top 0.305: U1.4 64.14,12.26 65.41,10.98 65.41,9.71 66.33,8.7 C18.1
N$52
  Top 0.305: U1.3 62.87,11.84 C17.2
N$53
  Top 0.305: U1.1 60.33,12.26 60.96,11.62 62.23,11.62 62.87,10.98 62.87,9.71 63.28,9.08 C17.1
PROTECT_GATE
  Top 0.305: 10.79,81.47 10.79,79.26 D2.A 10.46,77.11 R1.1
  Top 0.61: 10.79,81.47 Q1.4
PRXD_PIN2_RS232
  Top 0.305: 67.94,12.89 U1.7 67.94,13.53 69.22,14.79 69.22,15.43 71.75,17.97 RS232.1
PTXD_PIN3_RS232
  Top 0.305: U1.8 69.59,13.27 71.75,15.43 RS232.2
PUSH1  (via drill 0.5)
  Top 0.305: R9.2 10.38,40.02 | 10.38,40.02 C15.1 | AT328.32 42.92,35.84 v43.43,35.96 | v11.56,40.02 10.38,40.02
  Bottom 0.305: v43.43,35.96 38.73,40.66 12.06,40.66 v11.56,40.02
PUSH2  (via drill 0.5)
  Top 0.305: R10.2 10.38,34.3 | 10.38,34.3 C14.1 | AT328.11 44.52,26.61 v43.81,27.32 | v11.56,34.3 10.38,34.3
  Bottom 0.305: v43.81,27.32 43.81,28.59 40.64,31.77 40.64,33.67 36.2,38.12 14.61,38.12 11.56,34.94 v11.56,34.3
PUSH3  (via drill 0.5)
  Top 0.305: R11.2 10.38,28.59 | 10.38,28.59 C13.1 | AT328.12 45.32,27.72 v45.09,27.95 | v11.68,29.73 11.43,29.4 10.79,29.23 10.38,28.59
  Bottom 0.305: v45.09,27.95 45.09,28.59 41.27,32.4 41.27,34.3 36.83,38.75 13.97,38.75 8.89,33.67 8.89,30.5 9.53,29.78 10.16,29.78 11.43,29.73 v11.68,29.73
PWM_FLEX_1
  Top 0.305: AT328.1 38.48,32.84 38.1,33.21 38.1,34.48 38.73,35.11 39.37,35.11 43.18,38.92 46.99,38.92 56.52,48.45 62.87,48.45 64.14,49.72 64.14,54.16 59.05,59.24 59.05,67.5 56.52,70.04 54.4,70.04 R51.2 50.85,71.31 Q14.1
PWM_FLEX_2  (via drill 0.5)
  Top 0.305: AT328.13 46.12,26.62 46.61,27.11 48.39,27.11 v48.51,27.24 | v50.16,43.37 55.88,49.09 57.78,49.09 58.42,49.72 58.42,66.87 55.88,69.41 R30.2 49.74,69.83 49.28,70.29 47.37,70.29 45.72,71.94 45.72,72 Q10.1
  Bottom 0.305: v48.51,27.24 48.64,27.24 50.16,28.77 v50.16,43.37
PWM_FLEX_3  (via drill 0.5)
  Top 0.305: Q11.1 41.27,72 41.91,71.94 43.18,70.67 44.45,70.67 46.74,68.39 49.02,68.39 49.74,67.67 R29.2 50.8,67.5 52.07,66.23 52.07,64.96 52.7,64.33 53.98,64.33 55.88,62.42 v55.88,61.78 | v70.48,53.53 70.48,50.99 v71.12,50.35
  Bottom 0.305: SJ2.3 SJ1.3 v71.12,50.35 | v70.48,53.53 69.85,54.16 69.85,57.34 64.77,62.42 59.69,62.42 59.05,61.78 v55.88,61.78
PWM_LED2_OR_FLEX3  (via drill 0.5)
  Top 0.305: AT328.10 43.72,24.41 v43.81,24.32 | v64.14,42.1 v69.22,42.1
  Bottom 0.305: v43.81,24.32 44.45,24.32 45.09,24.95 47.62,24.95 64.14,41.47 v64.14,42.1 | v69.22,42.1 72.39,42.1 73.66,43.37 SJ2.2
PWM_LED_1  (via drill 0.5)
  Top 0.305: AT328.9 42.44,26.23 v39.37,26.23 | U5.3 85.12,70.64 v86.36,69.41
  Bottom 0.305: v39.37,26.23 38.73,25.59 38.73,24.95 40.64,23.05 44.45,23.05 45.72,24.32 48.26,24.32 65.41,41.47 65.41,57.34 66.04,57.98 67.31,57.98 67.94,57.34 67.94,56.07 68.58,55.44 68.58,52.9 69.85,51.62 86.36,51.62 90.81,56.07 90.81,64.96 v86.36,69.41
PWM_LED_2  (via drill 0.5)
  Top 0.305: U4.3 75.25,69.08 v74.93,68.77 | v79.38,57.98 79.38,53.53 78.74,52.9 78.74,50.99 77.47,49.72 v76.83,49.72
  Bottom 0.305: SJ2.1 SJ1.1 76.2,49.09 v76.83,49.72 | v74.93,68.77 74.93,64.33 79.38,59.88 v79.38,57.98
RAW_FUSED  (via drill 0.5)
  Top 0.305: R2.2 64.56,44.42 64.77,44.64 76.83,44.64 v78.74,46.55
  Top 0.61: C10.1 29.21,69.41 29.84,68.77 | 33.83,78.93 33.02,78.93 C5.+
  Top 0.813: F2.1 55.24,78.3 F1.P$2
  Top 1.27: 33.83,78.93 C1.+ | C1.+ C4.+ | C5.+ 40.18,78.75 41.27,77.66 48.26,77.66 48.9,78.3 48.9,81.47 RGB-LED.1 48.26,82.74 48.9,82.11 48.9,81.22 RGB-LED.2 | IC1.1 30.89,67.73 29.84,68.77 27.94,70.67 27.94,77.03 26.21,78.75 C1.+
  Bottom 0.305: v78.74,46.55 80.64,48.45 86.36,48.45
  Bottom 1.27: EXT1.RAW2 EXT1.RAW 86.36,21.14 88.9,23.68 92.71,23.68 94.23,25.46 94.23,39.31 92.71,40.83 87.63,40.83 86.36,42.1 EXT2.RAW2 EXT2.RAW 86.36,48.45 86.36,49.09 87.63,50.35 92.71,50.35 93.34,51.16 93.34,73.22 85.72,77.66 77.47,77.66 v76.83,78.3
  other vias: 77.98,79.44 78.11,78.3 71.88,78.42 70.61,78.42
  pour Bottom (isolate 0.305, no thermals): 45.72,88.45 45.72,78.3 51.44,78.3 52.7,76.39 57.15,76.39 57.78,79.56 59.05,80.83 67.94,80.83 70.48,77.03 79.38,77.03 79.38,79.56 77.47,80.83 77.47,88.45
  pour Top (isolate 0.254): 71.75,63.69 71.75,61.78 73.03,61.78 73.03,59.88 81.92,59.88 81.92,61.78 83.19,61.78 83.19,63.69 79.38,69.41 79.38,71.94 80.64,73.22 80.64,78.93 77.47,80.83 75.56,80.83 75.56,79.56 68.58,79.56 72.39,73.22 76.2,72.58 76.2,69.41
RAW_POL_PROTECTED  (via drill 0.5)
  Top 1.27: TVS.C 54.61,66.23 F1.P$1MOV
  other vias: 8.89,78.93 8,77.41 11.56,76.14 11.56,77.41 9.27,77.15 8.89,77.91
  pour Top (isolate 0.406, rank 2, no thermals): 6.99,85.92 12.06,85.92 12.06,75.12 10.79,75.12 6.99,77.03
  pour Bottom (isolate 0.406, rank 2, no thermals): 6.99,79.56 19.05,79.56 26.04,72.58 49.53,72.58 52.7,69.41 54.61,69.41 55.88,68.14 55.88,66.87 54.61,65.59 51.44,65.59 48.26,68.14 23.5,68.14 16.51,75.12 10.79,75.12 6.99,77.03
RAW_UNPROTECTED  (via drill 0.5)
  other vias: 17.78,86.55 17.78,85.28 19.05,85.28 19.05,86.55 17.78,84.01 19.05,84.01
  pour Top (isolate 0.305, no thermals): 15.24,87.82 24.13,87.82 24.13,82.74 20.32,82.74 18.41,80.83 15.24,80.83
  pour Bottom (isolate 0.305, no thermals): 3.81,85.92 15.24,85.92 17.78,88.45 24.13,88.45 24.13,82.74 10.16,82.74 6.99,79.56 6.99,77.03 6.35,76.39 4.45,76.39 3.81,77.03
READ_BATTERY  (via drill 0.5)
  Top 0.305: Q7.1 64.56,38.76 R4.2 63.5,40.62 62.87,41.25 v62.87,43.37
  Bottom 0.305: v62.87,43.37 59.05,47.81 59.05,56.7 57.78,57.98 35.56,57.98 33.77,56.19 U$4.22
REG_RCK
  Top 0.254: U$4.11 21.13,51.16
  Top 0.305: 21.13,51.16 19.05,49.09 18.41,49.09 15.88,46.55 15.88,45.27 16.51,44.64 IC2.2
REG_RCK_5V  (via drill 0.5)
  Top 0.305: IC2.18 29.84,43.37 v31.24,44.77 | v41.91,24.95 43.81,23.05 45.09,23.05 46.99,21.14 46.99,20.51 47.62,19.88 U2.12 | U6.2 31.11,20.51 32.38,21.78 | 32.38,21.78 36.07,21.78 v36.2,21.65 | R43.2 27.94,20.51 29.21,21.78 32.38,21.78
  Bottom 0.305: v31.24,44.77 31.75,45.27 36.2,45.27 36.83,45.91 36.83,47.81 38.1,49.09 39.37,49.09 40.64,47.81 40.64,45.27 46.99,38.92 46.99,35.11 48.26,33.84 48.26,31.94 48.9,31.3 48.9,28.77 45.72,25.59 42.55,25.59 v41.91,24.95 40.64,26.23 40.64,27.5 40.01,28.13 38.73,28.13 36.83,26.23 36.83,22.41 v36.2,21.65
RELAY1  (via drill 0.5)
  Top 0.305: Q5.1 64.56,29.86 R22.2 63.5,31.94 59.69,35.75 v59.69,42.1
  Bottom 0.305: v59.69,42.1 59.69,43.37 53.98,50.35 53.98,51.2 53.77,51.2 U$4.37
RELAY_CHARGE_BOARD  (via drill 0.5)
  Top 0.305: v13.97,70.04 13.97,65.59 15.24,64.33 20.32,64.33 v24.13,60.52
  Bottom 0.305: JP1.1 11.43,75.12 13.97,72.58 v13.97,70.04 | v24.13,60.52 28.57,56.07 28.57,54.16 U$4.18
RESET  (via drill 0.5)
  Top 0.305: Q13.2 21.44,15.06 R44.1 21.59,12.89 22.23,12.26 22.23,10.98 20.32,9.08 v15.88,9.08 | v3.17,9.08 2.54,9.08 0.64,10.98 0.64,42.73 1.91,44.01 v3.17,44.01 | U$4.13 23.54,49.77 v22.23,48.45
  Bottom 0.305: v15.88,9.08 v3.17,9.08 | v3.17,44.01 3.17,44.64 3.81,45.27 8.89,45.27 10.16,46.55 10.16,48.45 10.79,49.09 21.59,49.09 v22.23,48.45
RESET_5V  (via drill 0.5)
  Top 0.305: v38.86,33.59 39.37,33.84 43.81,38.29 44.45,38.29 45.4,37.34 45.32,37.26 AT328.29 | C26.2 R21.1 14.82,16.91 15.24,17.34 15.24,21.14 15.88,21.78 | 15.88,21.78 15.88,26.86 ISP.5 | Q13.3 18.41,21.14 17.78,21.78 15.88,21.78
  Bottom 0.305: ISP.5 17.14,28.77 15.24,26.86 15.24,25.59 13.97,24.32 12.7,24.32 11.43,25.59 11.43,27.5 20.95,37.02 35.81,37.02 v38.86,33.59
RNC
  Bottom 1.27: RELAY1.O 86.36,35.11 73.66,35.11 72.39,33.84 72.39,31.3 73.66,30.04 78.74,30.04 81.28,27.5 81.28,24.95 74.93,18.61 74.93,11.62 72.39,9.08 71.12,9.08 RELAY.3
RNO
  Bottom 1.27: RELAY1.S 89.53,26.86 88.27,26.86 78.74,17.34 78.74,10.35 74.3,5.91 RELAY.1
RR
  Bottom 0.813: F5.2 48.69,77.1 46.61,79.18 RGB-LED.4 46.61,81.22 45.72,82.11 45.72,82.61 RGB-LED.3
RST1
  Top 0.305: U2.3 45.09,14.16 43.81,15.43 33.66,15.43 | 33.66,15.43 31.11,12.89 29.21,12.89 27.3,10.98 27.3,7.81 TITREUR1.1 | R16.1 34.29,16.06 33.66,15.43
RST2
  Top 0.254: 32.38,10.98 29.84,10.98
  Top 0.305: U2.1 42.44,12.99 41.27,14.16 34.92,14.16 33.66,12.89 R14.1 33.23,11.84 32.38,10.98 | 29.84,10.98 28.57,9.71 28.57,4.63 27.94,4 TITREUR1.2
RST3
  Top 0.254: 43.81,18.61 U2.15 | 33.66,18.61 35.98,18.61
  Top 0.305: 33.66,18.61 33.02,17.97 33.02,16.06 30.48,13.53 28.57,13.53 26.67,11.62 26.67,9.71 TITREUR1.3 | 35.98,18.61 R13.1 37.05,17.76 38.1,16.7 42.55,16.7 43.81,17.97 43.81,18.61
RST4
  Top 0.254: U2.2 43.81,12.89
  Top 0.305: U2.2 43.81,14.16 43.18,14.79 34.29,14.79 31.33,11.84 R15.1 30.9,11.62 29.21,11.62 27.94,10.35 27.94,5.91 27.3,5.27 24.77,5.27 TITREUR1.4
RST5
  Top 0.305: U2.6 48.9,11.62 50.38,10.13 R19.1 53.55,9.71 53.98,9.08 TITREUR2.1
RST6
  Top 0.254: 50.8,10.98 54.9,10.98
  Top 0.305: 50.8,10.98 50.16,11.62 U2.7 | 54.9,10.98 R20.1 55.97,9.71 56.52,9.08 58.42,7.17 58.42,5.91 TITREUR2.2
RST7
  Top 0.305: U2.4 46.35,10.98 | R17.1 45.51,10.13 46.35,10.98 | TITREUR2.3 53.09,6.79 52.07,7.81 50.16,7.81 46.99,10.98 46.35,10.98
RST8
  Top 0.254: 37.47,10.98 45.09,10.98
  Top 0.305: 37.47,10.98 36.62,10.13 R18.1 37.88,8.45 46.35,8.45 47.62,7.17 47.62,5.91 48.01,5.52 50.16,5.52 50.42,5.27 52.07,5.27 53.09,4.25 TITREUR2.4 | 45.09,10.98 45.72,11.62 45.72,14.16 46.35,14.79 46.99,14.79 47.62,14.16 U2.5
RX-I  (via drill 0.5)
  Top 0.305: AT328.30 44.45,34.26 44.45,33.67 45.72,32.4 v46.35,32.4
  Bottom 0.305: PROG1.3 13.34,13.35 3.17,13.35 1.91,14.62 1.91,38.75 3.17,40.02 8.26,40.02 10.16,41.92 40.01,41.92 43.18,38.75 44.45,38.75 45.72,37.48 45.72,33.03 v46.35,32.4
RXA+  (via drill 0.5)
  Top 0.305: v63.5,57.34 66.04,57.34 v66.67,56.7 | R48.2 56.09,24.74 v56.52,24.32 57.78,25.59 R47.1
  Bottom 0.305: v63.5,57.34 61.59,57.34 60.33,58.61 30.48,58.61 26.67,62.42 21.59,62.42 20.32,61.15 20.32,57.98 18.41,56.07 18.41,54.16 U$4.10 | v66.67,56.7 66.67,56.07 67.94,54.8 67.94,54.16 67.31,53.53 67.31,26.23 69.22,24.32 69.22,23.68 67.94,22.41 58.42,22.41 v56.52,24.32
RXA+_5V  (via drill 0.5)
  Top 0.305: U1.9 v69.22,21.78 69.22,24.95 68.58,25.59 R47.2
  Bottom 0.305: A+_UART.2 57.15,26.86 55.24,24.95 55.24,23.68 57.15,21.78 v69.22,21.78
S1  (via drill 0.5)
  Top 0.305: INPUT.7 7.41,40.83 R9.1 R6.1 6.35,42.73 v1.91,47.18
  Bottom 0.305: v1.91,47.18 3.17,48.45 3.17,50.61 S1.2
S2
  Top 0.305: INPUT.6 8.04,34.48 R10.1 R7.1
S3
  Top 0.305: INPUT.5 8.04,30.67 R8.1 R11.1
SCK
  Top 0.305: U$4.23 36.2,51.68 34.92,49.72 36.2,48.45 36.2,40.2 35.56,39.56 IC2.15
SCK_5V  (via drill 0.5)
  Top 0.254: ISP.3 20.32,28.77
  Top 0.305: IC2.5 19.68,40.83 20.32,40.2 ISP.3 | 20.32,28.77 19.05,27.5 19.05,23.05 22.86,19.24 22.86,13.35 23.5,12.71 23.5,8.91 TITREUR1.5 22.23,5.27 22.23,3.37 23.5,2.09 53.98,2.09 55.24,3.37 55.24,5.27 54.99,5.52 53.09,5.52 52.07,6.54 TITREUR2.5 | EXT2.SCK 93.98,40.96 93.98,37.02 90.81,33.84 90.81,31.94 93.98,28.77 93.98,22.41 92.71,21.14 92.71,17.97 91.57,16.83 EXT1.SCK 91.44,9.97 U$8.7 88.65,2.48 87.63,1.46 83.82,1.46 80.9,4.38 80.9,5.65 78.74,7.81 76.2,7.81 75.56,7.17 59.69,7.17 57.15,9.71 57.15,17.34 52.7,21.78 50.16,21.78 | v49.53,16.7 48.9,17.34 U2.11 48.9,20.51 50.16,21.78 | 50.16,21.78 50.16,27.08 AT328.17 52.87,27.23 R40.2
  Bottom 0.305: TITREUR2.5 48.9,9.08 48.9,16.06 v49.53,16.7
TELECO_CS
  Top 0.305: U$4.35 48.6,49.09 43.81,49.09 42.55,47.81 42.55,41.47 40.01,38.92 38.73,38.92 37.47,37.66 35.56,37.66 32.38,34.48 IC2.11
TELECO_CS_5V  (via drill 0.5)
  Top 0.305: v85.72,2.73 84.45,4 84.45,7.05 U$8.3 | IC2.9 16.51,35.75 15.24,34.48 15.24,25.59 13.97,24.32 v13.97,21.14
  Bottom 0.305: v13.97,21.14 16.51,18.61 21.59,18.61 22.86,17.34 22.86,9.71 21.59,8.45 17.14,8.45 16.51,7.81 15.24,7.81 14.61,8.45 7.62,8.45 6.35,7.17 6.35,3.37 8.89,0.83 84.45,0.83 85.72,2.09 v85.72,2.73
TX-O  (via drill 0.5)
  Top 0.305: v44.45,36.84 44.45,35.75 43.72,35.11 AT328.31
  Bottom 0.305: PROG1.2 12.32,17.16 3.81,17.16 2.54,18.43 2.54,34.94 3.81,36.21 7.62,36.21 10.16,38.75 10.16,40.66 10.79,41.29 39.37,41.29 43.18,37.48 43.81,37.48 v44.45,36.84
TXA+_5V  (via drill 0.5)
  Top 0.305: v62.87,58.61 66.04,58.61 67.94,56.7 67.94,55.44 v66.67,54.16 | U1.10 v67.94,24.32 67.69,24.07 A+_UART.1
  Bottom 0.305: v62.87,58.61 62.23,58.61 61.59,59.24 31.11,59.24 27.3,63.05 20.95,63.05 19.68,61.78 19.68,59.24 15.24,54.8 15.34,54.8 U$4.8 | v66.67,54.16 66.67,25.59 v67.94,24.32

## Text on the board
tPlace: - | + | o | o | o | o
tNames: 5 | 3 | 2
bNames: LED 10W 2 | FLEX B | DIGITAL | PWM | CARTE DNC V0.3 | Pierre H Olivier R | fev 2015
bValues: 5V IPOD
Document: BRD+13,5mm | BRD+10mm | BRD+10mm | BRD+8mm | BRD+8mm | BRD+4mm diam4mm | RPI-2mm | RPI+7mm | BRD+8mm | RPI+3mm | RPI+6mm | RPI+3mm diam15mm | titreur BRD+7mm | titreur BRD+7mm | BRD+13,5mm | BRD+8mm